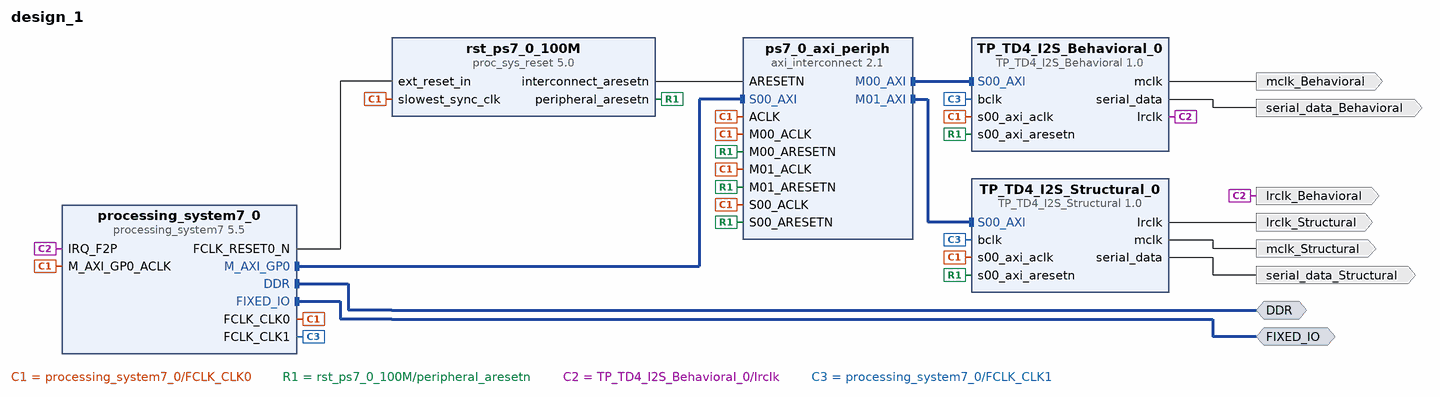
[diagram p0: block diagram of the top level]
# Vivado block design design_1, xc7z020clg484-1, Vivado 2017.1
create_bd_design design_1

create_bd_intf_port -mode Master -vlnv xilinx.com:interface:ddrx_rtl:1.0 DDR
create_bd_intf_port -mode Master -vlnv xilinx.com:display_processing_system7:fixedio_rtl:1.0 FIXED_IO
create_bd_port -dir O lrclk_Behavioral
create_bd_port -dir O serial_data_Behavioral
create_bd_port -dir O mclk_Behavioral
create_bd_port -dir O lrclk_Structural
create_bd_port -dir O serial_data_Structural
create_bd_port -dir O mclk_Structural

create_bd_cell -type ip -vlnv xilinx.com:ip:processing_system7:5.5 processing_system7_0
set_property -dict [list \
  CONFIG.PCW_FPGA1_PERIPHERAL_FREQMHZ 1.536 \
  CONFIG.PCW_USE_FABRIC_INTERRUPT 1 \
  CONFIG.PCW_EN_CLK1_PORT 1 \
  CONFIG.PCW_IRQ_F2P_INTR 1 \
  CONFIG.preset ZedBoard \
] [get_bd_cells processing_system7_0]
create_bd_cell -type ip -vlnv user.org:user:TP_TD4_I2S_Behavioral:1.0 TP_TD4_I2S_Behavioral_0
create_bd_cell -type ip -vlnv xilinx.com:ip:axi_interconnect:2.1 ps7_0_axi_periph
set_property -dict {CONFIG.NUM_MI 2} [get_bd_cells ps7_0_axi_periph]
create_bd_cell -type ip -vlnv xilinx.com:ip:proc_sys_reset:5.0 rst_ps7_0_100M
create_bd_cell -type ip -vlnv user.org:user:TP_TD4_I2S_Structural:1.0 TP_TD4_I2S_Structural_0

# ---- connections ----

connect_bd_intf_net [get_bd_intf_pins processing_system7_0/M_AXI_GP0] [get_bd_intf_pins ps7_0_axi_periph/S00_AXI]
connect_bd_intf_net [get_bd_intf_pins ps7_0_axi_periph/M00_AXI] [get_bd_intf_pins TP_TD4_I2S_Behavioral_0/S00_AXI]
connect_bd_intf_net [get_bd_intf_pins ps7_0_axi_periph/M01_AXI] [get_bd_intf_pins TP_TD4_I2S_Structural_0/S00_AXI]
connect_bd_intf_net [get_bd_intf_ports DDR] [get_bd_intf_pins processing_system7_0/DDR]
connect_bd_intf_net [get_bd_intf_ports FIXED_IO] [get_bd_intf_pins processing_system7_0/FIXED_IO]
connect_bd_net [get_bd_pins processing_system7_0/FCLK_CLK0] \
  [get_bd_pins processing_system7_0/M_AXI_GP0_ACLK] [get_bd_pins ps7_0_axi_periph/S00_ACLK] \
  [get_bd_pins rst_ps7_0_100M/slowest_sync_clk] [get_bd_pins TP_TD4_I2S_Behavioral_0/s00_axi_aclk] \
  [get_bd_pins ps7_0_axi_periph/M00_ACLK] [get_bd_pins ps7_0_axi_periph/ACLK] \
  [get_bd_pins TP_TD4_I2S_Structural_0/s00_axi_aclk] [get_bd_pins ps7_0_axi_periph/M01_ACLK]
connect_bd_net [get_bd_pins processing_system7_0/FCLK_RESET0_N] [get_bd_pins rst_ps7_0_100M/ext_reset_in]
connect_bd_net [get_bd_pins rst_ps7_0_100M/peripheral_aresetn] \
  [get_bd_pins ps7_0_axi_periph/S00_ARESETN] [get_bd_pins TP_TD4_I2S_Behavioral_0/s00_axi_aresetn] \
  [get_bd_pins ps7_0_axi_periph/M00_ARESETN] [get_bd_pins TP_TD4_I2S_Structural_0/s00_axi_aresetn] \
  [get_bd_pins ps7_0_axi_periph/M01_ARESETN]
connect_bd_net [get_bd_pins rst_ps7_0_100M/interconnect_aresetn] [get_bd_pins ps7_0_axi_periph/ARESETN]
connect_bd_net [get_bd_pins TP_TD4_I2S_Behavioral_0/lrclk] [get_bd_ports lrclk_Behavioral] [get_bd_pins processing_system7_0/IRQ_F2P]
connect_bd_net [get_bd_pins TP_TD4_I2S_Behavioral_0/serial_data] [get_bd_ports serial_data_Behavioral]
connect_bd_net [get_bd_pins TP_TD4_I2S_Behavioral_0/mclk] [get_bd_ports mclk_Behavioral]
connect_bd_net [get_bd_pins processing_system7_0/FCLK_CLK1] [get_bd_pins TP_TD4_I2S_Behavioral_0/bclk] [get_bd_pins TP_TD4_I2S_Structural_0/bclk]
connect_bd_net [get_bd_pins TP_TD4_I2S_Structural_0/lrclk] [get_bd_ports lrclk_Structural]
connect_bd_net [get_bd_pins TP_TD4_I2S_Structural_0/serial_data] [get_bd_ports serial_data_Structural]
connect_bd_net [get_bd_pins TP_TD4_I2S_Structural_0/mclk] [get_bd_ports mclk_Structural]

# ---- address map ----
assign_bd_address -offset 0x43C00000 -range 64K -target_address_space [get_bd_addr_spaces processing_system7_0/Data] [get_bd_addr_segs TP_TD4_I2S_Behavioral_0/S00_AXI/S00_AXI_reg]
assign_bd_address -offset 0x43C10000 -range 64K -target_address_space [get_bd_addr_spaces processing_system7_0/Data] [get_bd_addr_segs TP_TD4_I2S_Structural_0/S00_AXI/S00_AXI_reg]

validate_bd_design
save_bd_design
